# Altium schematic sheet cs301_Group2_Offsets.SchDoc
size A4; SheetNumber: 3; SheetTotal: 3
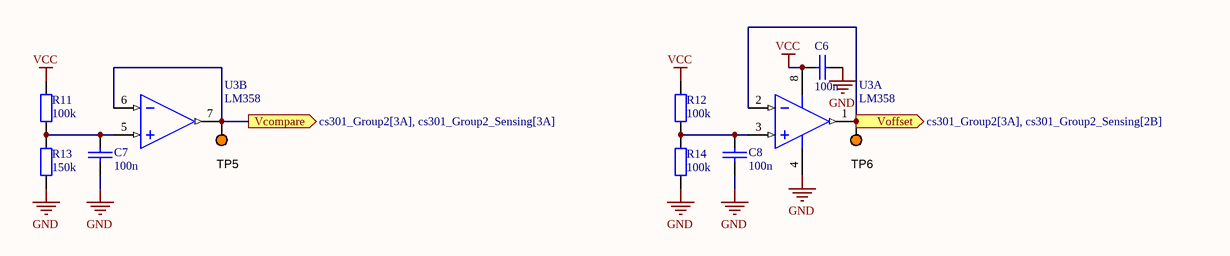
[diagram p0: cs301_Group2_Offsets.SchDoc]

## Parts
C6  100n  [0805 CAP]
C7  100n  [0805 CAP]
C8  100n  [0805 CAP]
R11  100k  [0805 RES]
R12  100k  [0805 RES]
R13  150k  [0805 RES]
R14  100k  [0805 RES]
TP5  5003  [TP_TH]  (value not drawn)
TP6  5003  [TP_TH]  (value not drawn)
U3  LM358  [SO - 8]  (parts A,B of 2)

## Ports
Vcompare (out, see cs301_Group2[3A], cs301_Group2_Sensing[3A]), Voffset (out, see cs301_Group2[3A], cs301_Group2_Sensing[2B])

## Nets
GND: C6.2 C7.1 C8.1 R13.2 R14.2 U3.4(VSS)
VCC: C6.1 R11.1 R12.1 U3.8(VDD)
Vcompare: TP5.1 U3.6(VINA-) U3.7(VOUTA) ; port Vcompare
Voffset: TP6.1 U3.1(VOUTA) U3.2(VINA-) ; port Voffset
NetC7_2: C7.2 R11.2 R13.1 U3.5(VINA+)
NetC8_2: C8.2 R12.2 R14.1 U3.3(VINA+)

## Library data of the parts
C6-C8 = CerCap_SMT_0805: SMT ceramic capacitor 0805 size; Value: *
R11-R14 = Res_SMT_0805: 0805 resistor; Published: 8-Jun-2000; LatestRevisionDate: 17-Jul-2002; LatestRevisionNote: Re-released for DXP Platform.; PackageReference: AXIAL-0.4; Publisher: Altium Limited; Value: *; ComponentLink1Description: https://nz.mouser.com/datasheet/2/315/AOA0000C304-1149620.pdf
TP5 TP6 = TestPoint: Test Point, Orange, 1-Pin THD, RoHS; Peak Reverse Current: 600 uA; Forward Current: 3 A; Max Surge Current: 80 A; Forward Voltage: 1.08 V; Max Operating Temperature: 150 degC; PackageReference: 5003; Pins: 2; ComponentLink2URL: http://keyelco.com/userAssets/file/M65p56.pdf; PackageDescription: 1-Pin Through Hole Device, Dia 2.54 mm; Weight: 0.01 lb; Diameter: 5.3 mm; Mount: Through Hole; Package Quantity: 500; Packaging: Bulk; Min Operating Temperature: -65 degC; ComponentLink1Description: Manufacturer URL; Height: 0.25 inch; ComponentLink1URL: http://www.keyelco.com/; ComponentLink2Description: Datasheet; Width: 0.25 inch; REACH SVHC: No SVHC; RoHSCompliant: true; Radiation Hardening: No; Length: 9.5 mm; DatasheetVersion: Jun-15
U3 = LM358_SMT_SOIC8: IC OPAMP 8SOIC; ComponentLink1URL: http://www.ti.com/lit/ds/symlink/tlc080a.pdf; ComponentLink1Description: http://www.ti.com/lit/ds/symlink/tlc080a.pdf; Supplier 1: Digi-Key; Supplier Part Number 1: 296-1014-1-ND